# Altium schematic sheet 533_4POV.SchDoc
size A4; SheetNumber: 15; SheetTotal: 18
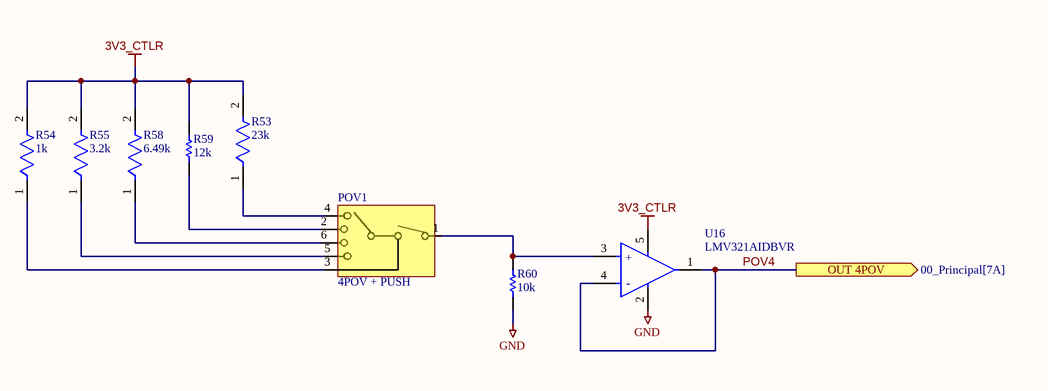
[diagram p0: 533_4POV.SchDoc]

## Parts
POV1  4POV + PUSH  [TSSJ 30]
R53  23k  [FP-AC0402-MFG]
R54  1k  [FP-MCS0402-IPC_B]
R55  3.2k  [FP-RN73R1E-IPC_A]
R58  6.49k  [FP-MCS0402-IPC_A]
R59  12k  [RESC0402(1005)_M]
R60  10k  [RESC1005X40X25ML05T05]
U16  LMV321AIDBVR  [FP-DBV0005A-MFG]

## Ports
OUT 4POV (out, see 00_Principal[7A])

## Nets
3V3_CTLR: R53.2 R54.2 R55.2 R58.2 R59.2 U16.5(V+)
GND: R60.1 U16.2(V-)
POV4: U16.1(OUT) U16.4(-IN) ; port OUT 4POV
NetPOV1_1: POV1.1(COM) R60.2 U16.3(+IN)
NetPOV1_2: POV1.2(DIRB) R59.1
NetPOV1_3: POV1.3 R54.1
NetPOV1_4: POV1.4(DIRA) R53.1
NetPOV1_5: POV1.5(DIRD) R55.1
NetPOV1_6: POV1.6(DIRC) R58.1

## Notes on the sheet
- (in symbol CMP-04895-000333-1) +; -

## Library data of the parts
POV1 = TSSJ 30: SWITCH NAVIGATION 20MA 15V
R53 = CMP-03412-015848-2: RES 23.2kΩ ±1% 0.063W 0402; Resistance: 23.2kR; Max Power Dissipation: 63mW; Temperature Coefficient: 100ppm/°C; Features: Moisture Resistant; Military Standard: Not; Max Operating Temperature: 155°C; RoHS Compliant: Yes; Resistor Type: Thick Film; Min Operating Temperature: -55°C; Length: 0.039inch; Height: 0.015inch; Number of Terminations: 2; Width: 0.02inch; Series: AC; Depth: 0.5mm; Tolerance: 1%; Packaging: Tape and Reel; Case/Package: 0402
R54 = CMP-2002-02445-2: RES SMD 1.2K OHM 1% 1/10W 0402; Resistance: 1kR; Tolerance: 0.1%; Max Power Dissipation: 63mW; Temperature Coefficient: 25ppm/°C; Max Operating Temperature: 125°C; Min Operating Temperature: -55°C; Case/Package: 0402; Packaging: Tape and Reel; Width: 0.02inch; Lead Free: Lead Free; Number of Terminations: 2; Height: 0.015inch; Package Quantity: 10000; Length: 0.039inch; Composition: Thin Film; Contact Plating: Tin; Depth: 0.5mm; Military Standard: Not
R55 = CMP-04015-034609-1: 3.2kΩ ±0.1% 0.063W, 1/16W Chip Resistor 0402 (1005 Metric) Moisture Resistant Thin Film
R58 = CMP-02407-008176-1: RES SMD 1.2K OHM 1% 1/10W 0402; Temperature Coefficient: 50ppm/°C; Resistance: 6.49kR; Max Power Dissipation: 100mW; Packaging: Tape and Reel; Lead Free: Lead Free; Tolerance: 1%; Case/Package: 0402; Length: 0.039inch; Height: 0.015inch; Package Quantity: 10000; Depth: 0.5mm; Composition: Thin Film; Width: 0.02inch; Min Operating Temperature: -55°C; Number of Terminations: 2; Military Standard: Not; Max Operating Temperature: 155°C
R59 = CMP-1011-00100-1: 12K 0.063W 5% 0402 (1005 Metric)  SMD; Case-Metric: 1005; Value: 12000.00 Ohm; Case-EIA: 0402; Technology: SMT; Tolerance: 5 %; Power: 0.063 W
R60 = CMP-2002-00601-1: Manufacturer: Panasonic; Part Number: ERJ-2RHD1002X
U16 = CMP-04895-000333-1: IC OPAMP GP 1 CIRCUIT SOT23-5; Input Bias Current: 10pA; Output Current per Channel: 40mA; Gain Bandwidth Product: 1MHz; Input Offset Voltage (Vos): 1mV; Number of Channels: 1; Operating Supply Current: 80uA; Slew Rate: 1.7V/µs; Mount: Surface Mount; Min Operating Temperature: -40°C; Packaging: Cut Tape; Case/Package: SOT-23-5; RoHS Compliant: Yes; Max Operating Temperature: 125°C; Number of Circuits: 1